# EAGLE design PWM (EAGLE 7.6.0)
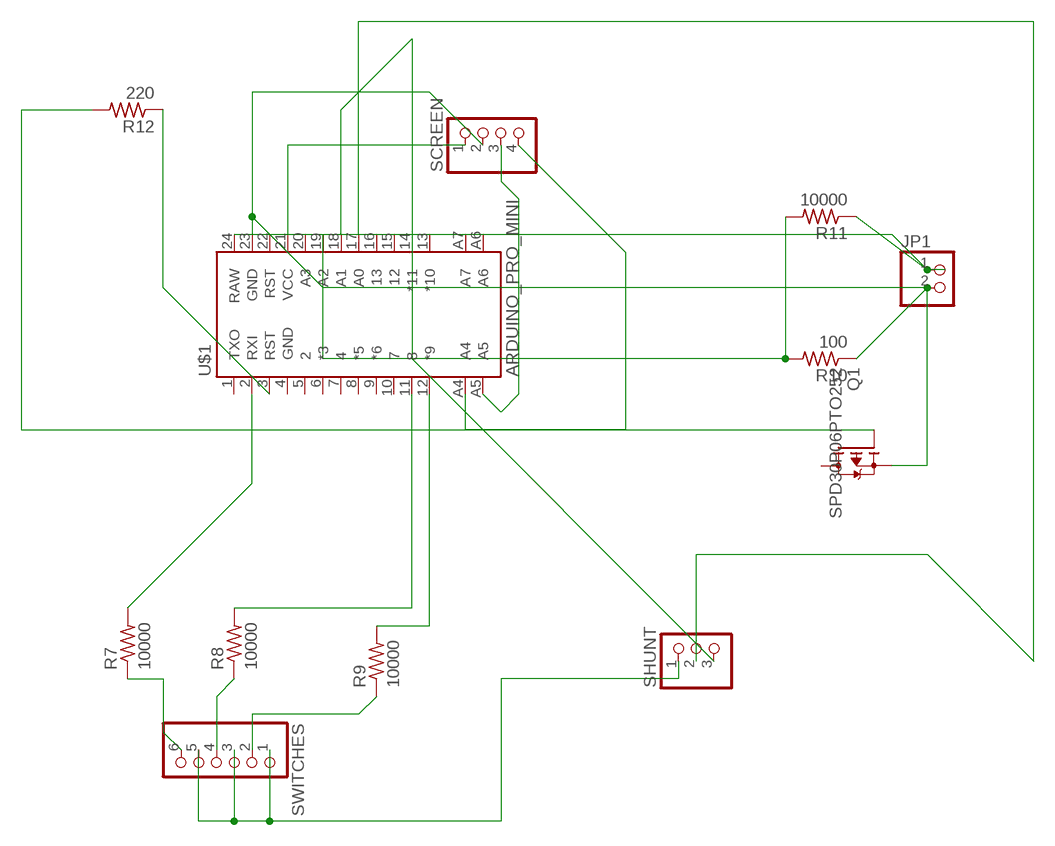
[diagram p0: schematic, sheet 1]

## Parts
JP1  PINHD-1X2  [1X02]
Q1  SPD30P06PTO252  [TO252]
R7  10000  R-US_0204/7  [0204/7]
R8  10000  R-US_0204/7  [0204/7]
R9  10000  R-US_0204/7  [0204/7]
R10  100  R-US_0204/7  [0204/7]
R11  10000  R-US_0204/7  [0204/7]
R12  220  R-US_0204/7  [0204/7]
SCREEN  PINHD-1X4  [1X04]
SHUNT  PINHD-1X3  [1X03]
SWITCHES  PINHD-1X6  [1X06]
U$1  ARDUINO_PRO_MINI  [ARDUINO_PRO_MINI]

## Nets
2: R7.1 R7.2 SWITCHES.6 U$1.2(RXI)
3: R12.1 U$1.3(RST)
11: R8.1 SWITCHES.4
12: R9.1 SWITCHES.2
19: R10.2 R11.2 U$1.19(A2)
A0: SHUNT.2 U$1.17(A0)
A1: SHUNT.3 U$1.18(A1)
A4: SCREEN.4 U$1.A4
A5: SCREEN.3 U$1.A5
FET: Q1.1(G) R12.2
GND: JP1.2 Q1.2(S) R10.1 SCREEN.2 SHUNT.1 SWITCHES.1 SWITCHES.3 SWITCHES.5 U$1.23(GND)
N$2: R9.2 U$1.12(*9)
N$3: R8.2 U$1.11
RAW: JP1.1 R11.1 U$1.24(RAW)
VCC: SCREEN.1 U$1.21(VCC)
Unconnected: Q1.3(D) U$1.1(TXO) U$1.4(GND) U$1.5 U$1.6(*3) U$1.7 U$1.8(*5) U$1.9(*6) U$1.10 U$1.13(*10) U$1.14(*11) U$1.15 U$1.16 U$1.20(A3) U$1.22(RST) U$1.A6 U$1.A7

## Library data of the parts
JP1 = pinhead:PINHD-1X2: PIN HEADER
Q1 = transistor-fet:SPD30P06P: SIPMOS(R) Power-Transistor P-Channel, Enhancement mode Source: http://www.infineon.com/upload/Document/cmc_upload/documents/012/3615/SPD_U30P06P.pdf
R7-R12 = adafruit:R-US_: RESISTOR, American symbol
SCREEN = pinhead:PINHD-1X4: PIN HEADER
SHUNT = adafruit:PINHD-1X3: PIN HEADER
SWITCHES = adafruit:PINHD-1X6: PIN HEADER
U$1 = SparkFun-Boards:ARDUINO_PRO_MINI

## Board
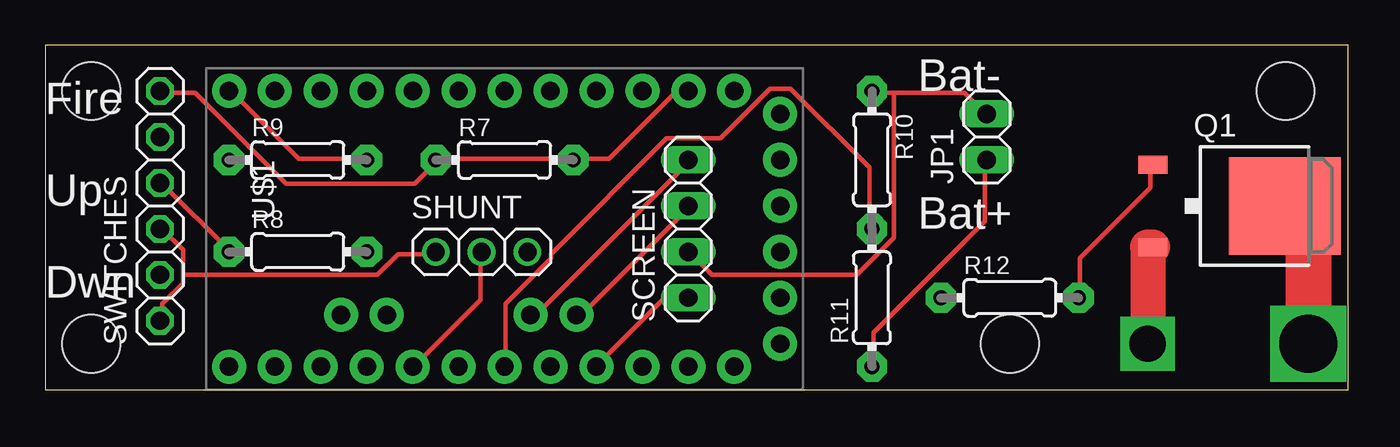
[diagram p1: board, top side]
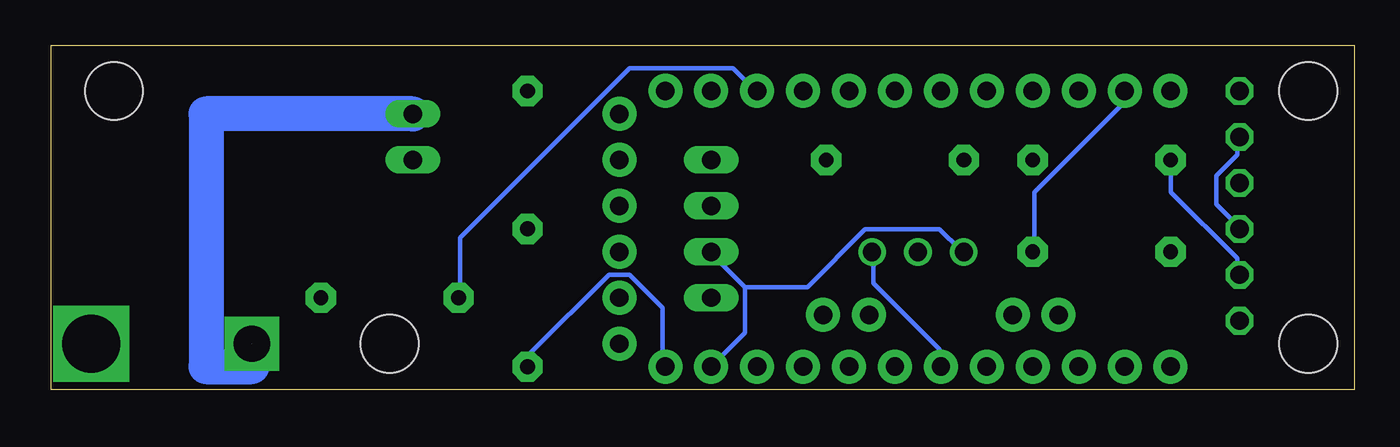
[diagram p2: board, bottom side, seen from below]

Size 72.06 x 19.04 mm. Coordinates in mm from the lower left corner, seen from the top.
Outline: 0,0 72.06,0 72.06,19.04 0,19.04 0,0
Copper layers (1*16): Top 0.035mm / dielectric 1.5mm / Bottom 0.035mm
Design rules "default": minimum track width 10mil, minimum drill 24mil, track to track 8mil, track to pad 8mil, pad to pad 8mil, via to via 8mil, smd to smd 8mil, copper to edge 40mil, drill to drill 8mil, minimum pad ring 10mil, minimum via ring 8mil, stop-mask expansion 4mil, vias tented up to drill 0mil, thermal gap 10mil
Holes 3.2 mm at 2.54,2.54 2.54,16.51 68.58,16.51 53.34,2.54

### Footprints (pad centres in the part's own frame; a part is rotated, then mirrored left to right if it is on the bottom)
1X02 = drill 1.016 long: 1 -1.27,0; 2 1.27,0
TO252 = smd 1 x 1.6: 1 -2.28,-4.8; 2 2.28,-4.8 | smd 5.4 x 6.2: 3 0,2.5
0204/7 = drill 0.813 pad 1.676 octagon: 1 -3.81,0; 2 3.81,0
1X04 = drill 1.016 long: 1 -3.81,0; 2 -1.27,0; 3 1.27,0; 4 3.81,0
1X03 = drill 1.016: 1 -2.54,0; 2 0,0; 3 2.54,0
1X06 = drill 1.016 octagon: 1 -6.35,0; 2 -3.81,0; 3 -1.27,0; 4 1.27,0; 5 3.81,0; 6 6.35,0
ARDUINO_PRO_MINI = drill 1.016 pad 1.88: 1 -7.62,12.7; 2 -7.62,10.16; 3 -7.62,7.62; 4 -7.62,5.08; 5 -7.62,2.54; 6 -7.62,0; 7 -7.62,-2.54; 8 -7.62,-5.08; 9 -7.62,-7.62; 10 -7.62,-10.16; 11 -7.62,-12.7; 12 -7.62,-15.24; 13 7.62,-15.24; 14 7.62,-12.7; 15 7.62,-10.16; 16 7.62,-7.62; 17 7.62,-5.08; 18 7.62,-2.54; 19 7.62,0; 20 7.62,2.54; 21 7.62,5.08; 22 7.62,7.62; 23 7.62,10.16; 24 7.62,12.7; A4 4.763,1.429; A5 4.763,3.969; A6 4.763,-9.049; A7 4.763,-6.509; BLK -6.35,15.24; GND -3.81,15.24; GRN 6.35,15.24; RXI 1.27,15.24; TXO 3.81,15.24; VCC -1.27,15.24

### Placement (x,y rotation side)
JP1  52.07,13.97 90 top
Q1  66.04,10.16 270 top
R7  25.4,12.7 0 top
R8  13.97,7.62 0 top
R9  13.97,12.7 0 top
R10  45.72,12.7 270 top
R11  45.72,5.08 90 top
R12  53.34,5.08 0 top
SCREEN  35.56,8.89 90 top
SHUNT  24.13,7.62 0 top
SWITCHES  6.35,10.16 90 top
U$1  25.4,8.89 270 top

### Tracks (layer width: path | path; a pad name or v marks a point on that pad's centre or on a via)
2
  Top 0.254: SWITCHES.6 6.48,16.41 8.31,16.41 13.34,11.38 20.42,11.38 21.56,12.52 R7.1 21.79,12.75 29.11,12.75 R7.2 29.34,12.75 31.17,12.75 34.82,16.41 35.51,16.41 U$1.2
3
  Bottom 0.254: R12.1 49.45,5.21 49.45,8.41 40.08,17.78 34.37,17.78 33.22,16.64 U$1.3
11
  Top 0.254: SWITCHES.4 6.48,11.38 10.13,7.72 R8.1
  Bottom 0.254: 6.48,11.38 SWITCHES.4 | 10.13,7.72 R8.1
12
  Bottom 0.254: SWITCHES.2 6.48,6.35 6.48,7.26 10.13,10.92 10.13,12.52 R9.1
19
  Top 0.254: 45.8,8.87 R10.2 45.57,9.09 45.57,12.29 41.22,16.64 40.08,16.64 37.34,13.89 34.37,13.89 27.96,7.49 27.96,7.26 25.45,4.75 25.45,1.32 U$1.19
A0
  Top 0.254: SHUNT.2 24.08,7.49 24.08,4.98 20.42,1.32 U$1.17
A1
  Bottom 0.254: SHUNT.3 26.59,7.49 26.59,5.89 22.94,2.23 22.94,1.32 U$1.18
A4
  Top 0.254: SCREEN.4 35.51,12.52 27.05,4.06 U$1.A4
A5
  Top 0.254: SCREEN.3 35.51,10.01 29.57,4.06 U$1.A5
FET
  Top 0.254: Q1.1 61.11,12.29 61.11,11.15 57.23,7.26 57.23,5.21 R12.2
GND  (1 unrouted)
  Top 0.254: 7.62,6.35 7.62,7.72 6.48,8.87 SWITCHES.3 | 7.62,6.35 7.62,5.89 6.48,4.75 6.48,3.84 SWITCHES.1 | 7.62,6.35 18.36,6.35 19.51,7.49 21.56,7.49 SHUNT.1 | 46.94,16.41 50.83,16.41 51.97,15.27 JP1.2 | 46.94,16.41 45.8,16.41 R10.1 | 46.94,16.41 46.94,8.41 44.88,6.35 36.88,6.35 35.74,7.49 SCREEN.2
  Top 1.93: Q1.2 60.96,7.88 60.96,2.54
  Bottom 0.254: SWITCHES.5 6.48,13.89 6.48,12.98 7.62,11.84 7.62,10.24 6.48,9.09 SWITCHES.3 | 33.68,5.66 35.51,7.49 SCREEN.2 | 33.68,5.66 33.68,3.15 U$1.23 | 33.68,5.66 30.25,5.66 27.05,8.87 22.94,8.87 21.79,7.72 SHUNT.1
  Bottom 1.93: JP1.2 63.5,15.24 63.5,1.27 60.96,1.27 60.96,2.54
N$1  (via drill 3.2)
  Top 2.54: 68.58,10.16 69.85,10.16 v69.85,2.54
N$2
  Top 0.254: R9.2 17.68,12.75 14.02,12.75 10.36,16.41 U$1.12
N$3
  Bottom 0.254: R8.2 17.68,7.72 17.68,10.92 12.88,15.72 12.88,16.41 U$1.11
N$4  (via drill 2)
  other vias: 60.96,2.54
RAW
  Top 0.254: JP1.1 51.97,12.52 51.97,9.32 45.8,3.15 45.8,1.32 R11.1
  Bottom 0.254: U$1.24 38.25,1.32 38.25,4.52 40.08,6.35 41.22,6.35 45.57,2.01 45.57,1.32 R11.1
VCC
  Top 0.254: SCREEN.1 35.51,4.98 34.14,4.98 30.48,1.32 U$1.21

### Text on the board
_tsilk: Bat- | Fire | Up | Bat+ | Dwn